# EAGLE design TSL267_breakout (EAGLE 7.3.0)
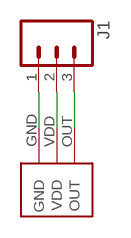
[diagram p0: schematic, sheet 1]

## Parts
J1  M03PTH  [1X03]
U$1  TSL267  [TSL267]

## Nets
N$1: J1.1 U$1.GND
N$2: J1.2 U$1.VDD
N$3: J1.3 U$1.OUT

## Library data of the parts
J1 = SparkFun-Connectors:M03: Header 3 Standard 3-pin 0.1" header. Use with straight break away headers (SKU : PRT-00116), right angle break away headers (PRT-00553), swiss pins (PRT-00743), machine pins (PRT-00117), and female headers (PRT-00115). Molex polarized connector foot print use with SKU : PRT-08232 with associated crimp pins and housings.
U$1 = awqua_eagle_library:TSL267

## Board
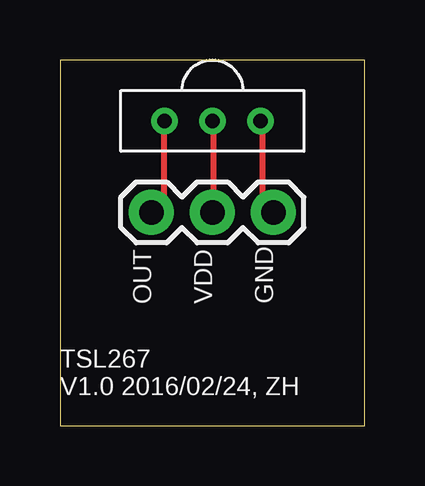
[diagram p1: board, top side]

Size 12.7 x 15.24 mm. Coordinates in mm from the lower left corner, seen from the top.
Outline: 0,0 12.7,0 12.7,15.24 0,15.23 0,0
Copper layers (1*16): Top 0.035mm / dielectric 1.5mm / Bottom 0.035mm
Design rules "default": minimum track width 10mil, minimum drill 24mil, track to track 8mil, track to pad 8mil, pad to pad 8mil, via to via 8mil, smd to smd 8mil, copper to edge 40mil, drill to drill 8mil, minimum pad ring 10mil, minimum via ring 8mil, stop-mask expansion 4mil, vias tented up to drill 0mil, thermal gap 10mil

### Footprints (pad centres in the part's own frame; a part is rotated, then mirrored left to right if it is on the bottom)
1X03 = drill 1.016 pad 1.88: 1 0,0; 2 2.54,0; 3 5.08,0
TSL267 = drill 0.6 pad 0.9: GND -2,0; OUT 2,0; VDD 0,0

### Placement (x,y rotation side)
J1  8.89,8.89 180 top
U$1  6.35,12.7 180 top

### Tracks (layer width: path | path; a pad name or v marks a point on that pad's centre or on a via)
N$1
  Top 0.254: U$1.GND 8.46,12.57 8.46,9.14 8.69,8.91 J1.1
N$2
  Top 0.254: U$1.VDD 6.4,12.57 6.4,8.91 J1.2
N$3
  Top 0.254: U$1.OUT 4.34,12.57 4.34,9.37 3.89,8.91 J1.3

### Text on the board
tPlace: OUT | VDD | GND | TSL267 / V1.0 2016/02/24, ZH